# Altium schematic sheet SH3 - RS-422.SchDoc
size Letter
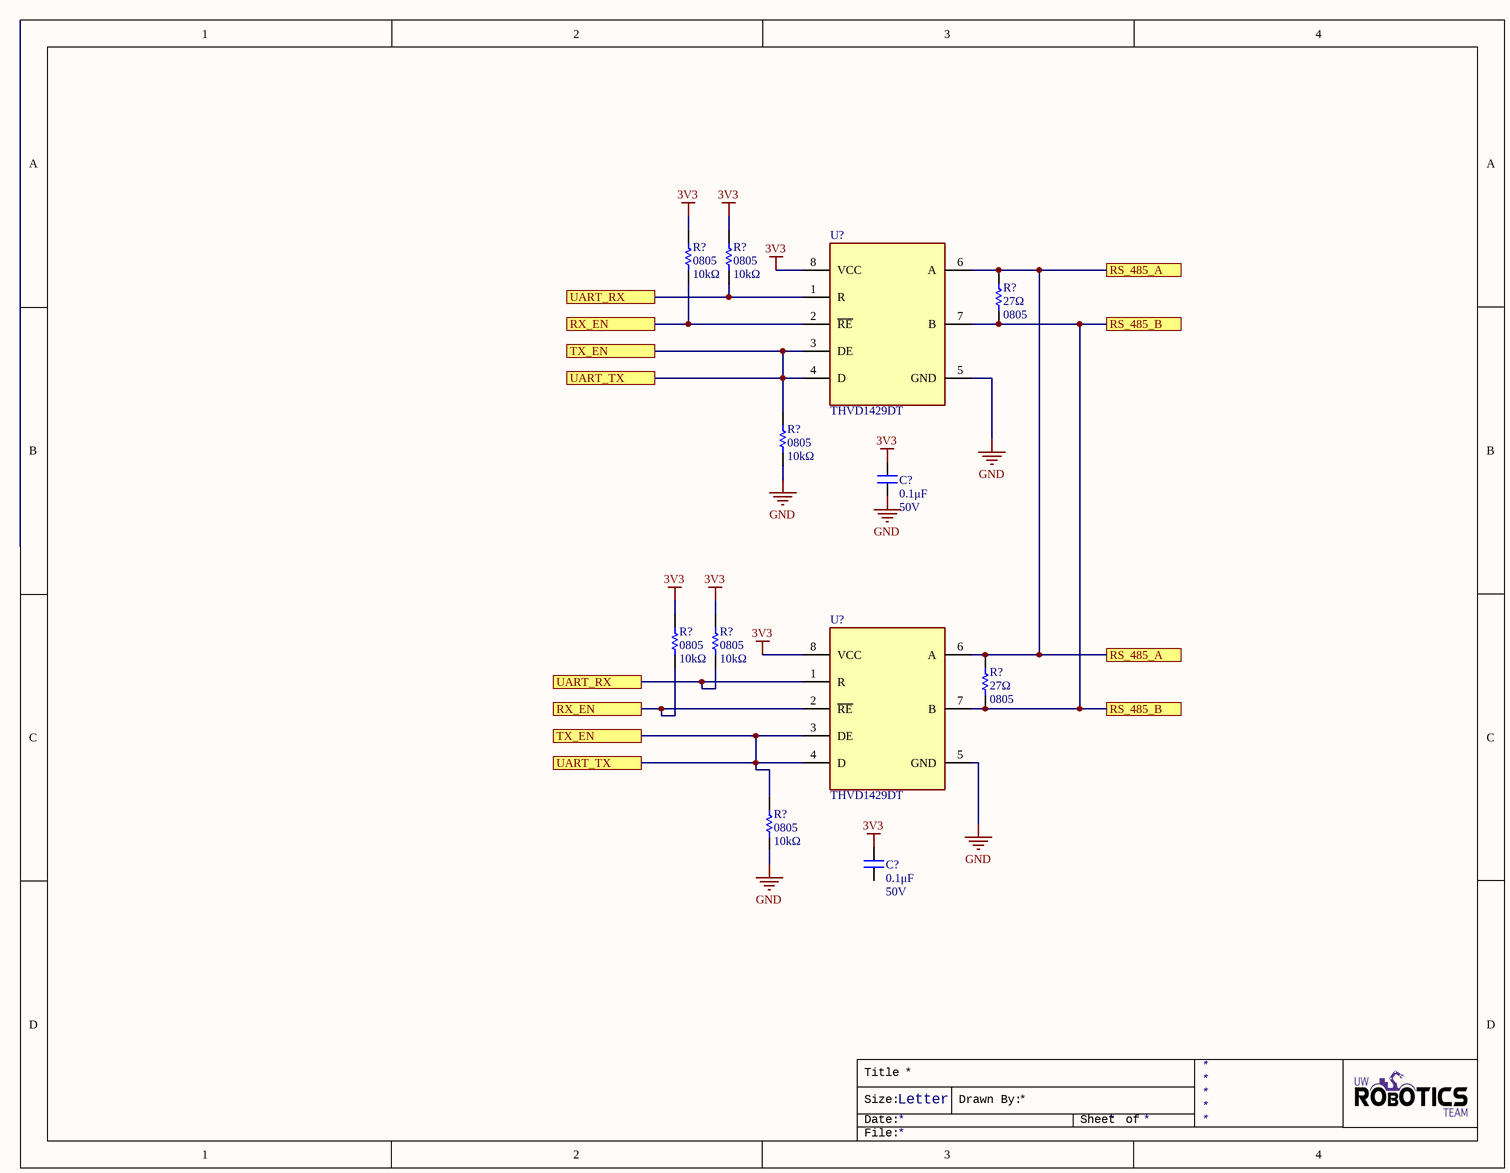
[diagram p0: SH3 - RS-422.SchDoc]

## Parts
(Parts that share a designator on the sheet are numbered #1, #2 ... from top to bottom, then left to right.)
C?#1  0.1μF  Voltage Rating: 50V  [CAPC2012X140N]
C?#2  0.1μF  Voltage Rating: 50V  [CAPC2012X140N]
R?#1  value 10kΩ  Case Code (Imperial): 0805  [RESC2012X60N]  (hidden comment: RES_10kΩ_0805)
R?#2  value 10kΩ  Case Code (Imperial): 0805  [RESC2012X60N]  (hidden comment: RES_10kΩ_0805)
R?#3  Resistance: 27Ω  Case/Package: 0805  [RESC2012X60N]  (hidden comment: RES_27Ω_0805)
R?#4  value 10kΩ  Case Code (Imperial): 0805  [RESC2012X60N]  (hidden comment: RES_10kΩ_0805)
R?#5  value 10kΩ  Case Code (Imperial): 0805  [RESC2012X60N]  (hidden comment: RES_10kΩ_0805)
R?#6  value 10kΩ  Case Code (Imperial): 0805  [RESC2012X60N]  (hidden comment: RES_10kΩ_0805)
R?#7  Resistance: 27Ω  Case/Package: 0805  [RESC2012X60N]  (hidden comment: RES_27Ω_0805)
R?#8  value 10kΩ  Case Code (Imperial): 0805  [RESC2012X60N]  (hidden comment: RES_10kΩ_0805)
U?#1  THVD1429DT  [8-SOIC_M]
U?#2  THVD1429DT  [8-SOIC_M]

## Ports
RS_485_A, RS_485_B, RX_EN, TX_EN, UART_RX, UART_TX

## Nets
3V3: C?#1.2 C?#2.2 R?#1.2 R?#2.2 R?#5.2 R?#6.2 U?#1.8(VCC) U?#2.8(VCC)
GND: C?#1.1 R?#4.1 R?#8.1 U?#1.5(GND) U?#2.5(GND)
RS_485_A: R?#3.2 R?#7.2 U?#1.6(A) U?#2.6(A) ; port RS_485_A
RS_485_B: R?#3.1 R?#7.1 U?#1.7(B) U?#2.7(B) ; port RS_485_B
RX_EN: R?#1.1 R?#5.1 U?#1.2(~{RE}) U?#2.2(~{RE}) ; port RX_EN
TX_EN: R?#4.2 R?#8.2 U?#1.3(DE) U?#1.4(D) U?#2.3(DE) U?#2.4(D) ; port UART_TX, port TX_EN
UART_RX: R?#2.1 R?#6.1 U?#1.1(R) U?#2.1(R) ; port UART_RX

Not connected (* = marked no-connect by the designer): C?#2 1

## Notes on the sheet
- Title
- Size:
- Date:
- Letter
- Drawn By:
- Sheet
- of
- File:

## Library data of the parts
C?#1 C?#2 = CAP_0.1uF_50V_0805: CAP CER 0.1UF 50V X7R 0805; Manufacturer 1: Murata Electronics; Manufacturer Part Number 1: GCD21BR71H104KA01L; Tolerance: 10%; Mount: Surface Mount; Case Code (Metric): 2012; Case Code (Imperial): 0805; Min Operating Temperature: -55°C; Max Operating Temperature: 125°C; Dielectric: X7R; Termination: SMD/SMT; Length: 2mm; Height: 1.25mm; Width: 0.049inch; Thickness: 0.049inch; Depth: 1.25mm; Ratings: AEC-Q200; Supplier 1: Digi-Key; Supplier Part Number 1: 490-11955-1-ND; Package: 0805 (2012 Metric); Value: 0.1μF
R?#1 R?#2 R?#4-R?#6 R?#8 = RES_10kΩ_0805: RES SMD 10K OHM 1% 1/8W 0805; Manufacturer 1: Yageo; Manufacturer Part Number 1: RC0805FR-0710KL; Power Rating: 125mW; Supplier 1: Digi-Key; Case Code (Metric): 2012; Min Operating Temperature: -55°C; Max Operating Temperature: 155°C; Resistance: 10K; Tolerance: 1%; Termination: SMD/SMT; Supplier Part Number 1: 311-10.0KCRCT-ND; Package: 0805 (2012 Metric)
R?#3 R?#7 = RES_27Ω_0805: RES SMD 27 OHM 1% 1/8W 0805; Manufacturer 1: Yageo; Manufacturer Part Number 1: RC0805FR-0727RL; Temperature Coefficient: 100ppm/°C; Working Voltage: 150V; Power Rating: 125mW; Supplier 1: Digi-Key; Case Code (Imperial): 0805; Case Code (Metric): 2012; Min Operating Temperature: -55°C; Max Operating Temperature: 155°C; Tolerance: 1%; Composition: Thick Film; Number of Terminations: 2; Termination: SMD/SMT; Voltage Rating: 150V; Military Standard: Not; Length: 2mm; Height: 0.5mm; Width: 1.25mm; Depth: 1.25mm; REACH SVHC: Unknown; Supplier Part Number 1: 311-27.0CRCT-ND
U?#1 U?#2 = THVD1429DT: IC RS-485 TRANSCEIVER HALF 1/1 8SOIC; MF: Texas Instruments; SnapEDA_Link: https://www.snapeda.com/parts/THVD1429DT/Texas%20Instruments/view-part/3603889/?ref=snap; Price: None; MP: THVD1429DT; DigiKey-Purchase-URL: https://snapeda.com/shop?store=DigiKey&id=3603889; Package: SOIC-8 Texas Instruments; Value: *; Manufacturer 1: Texas Instruments; Supplier 1: Digi-Key; Supplier part number 1: 296-53046-1ND; Manufacturer Part number 1: THVD1429DT